# EAGLE schematic 5409668 (EAGLE 6.6.0)

## Sheet 1 of 2
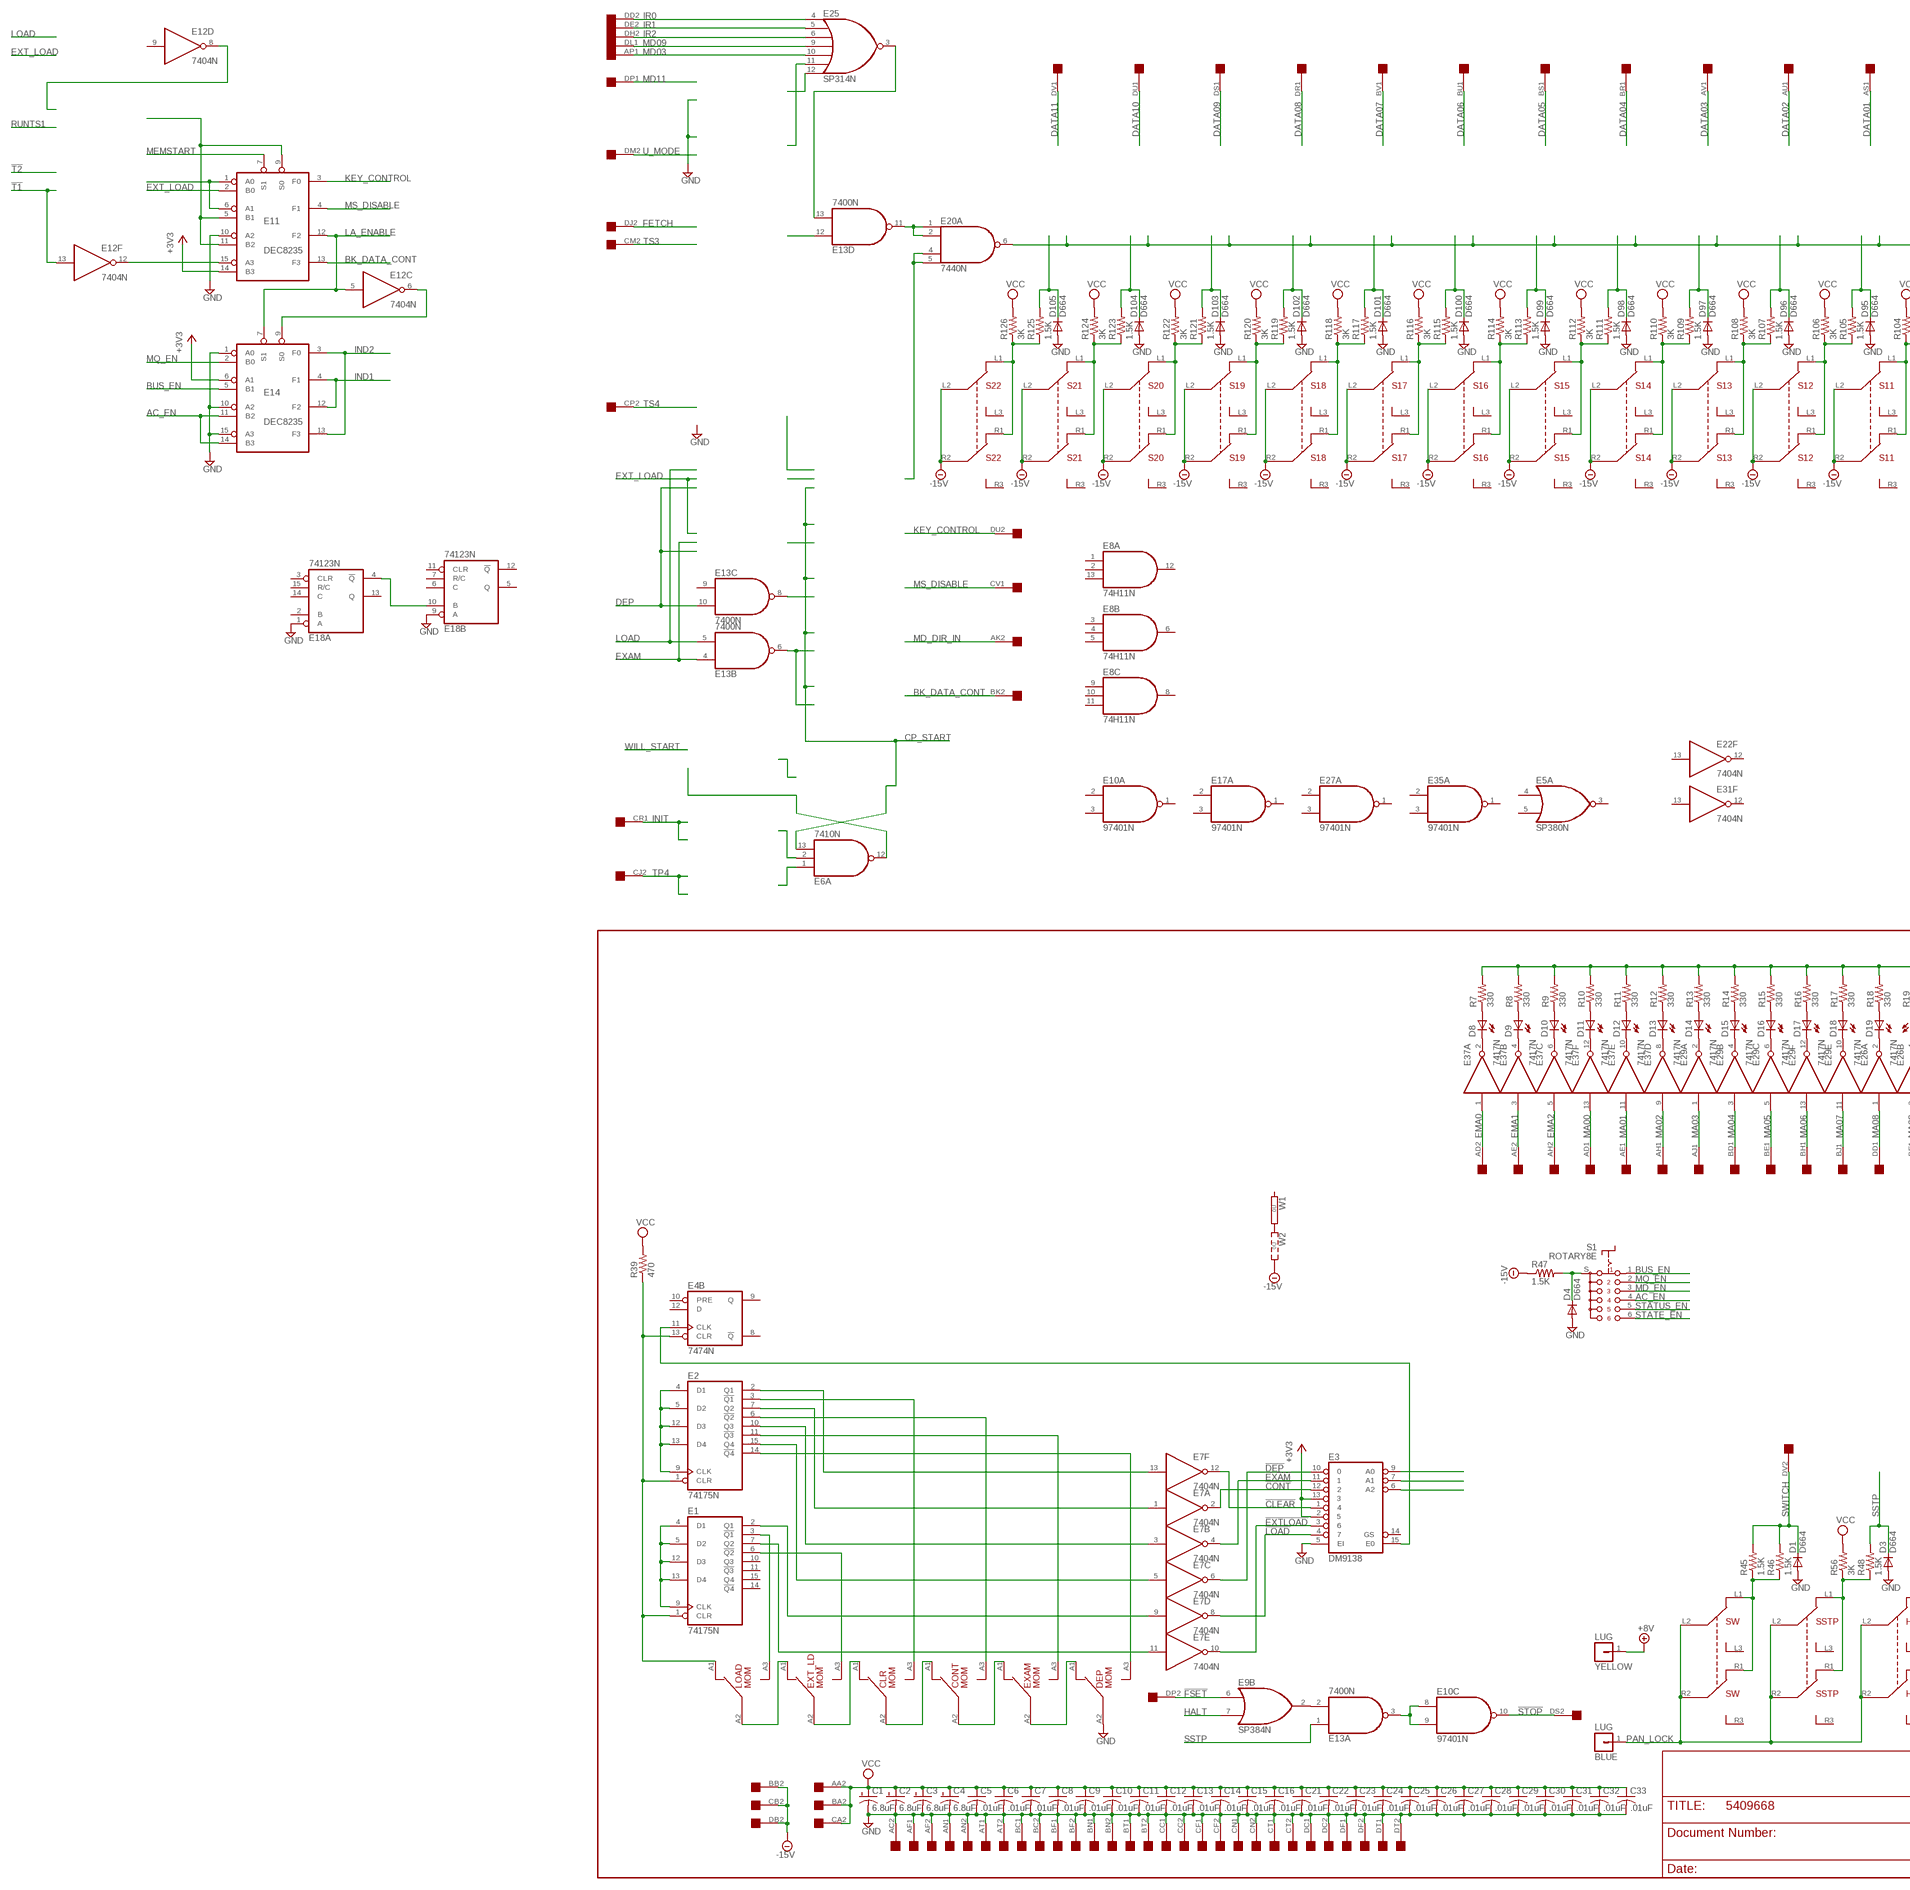
[diagram p0: schematic, sheet 1, part 1 of 2]
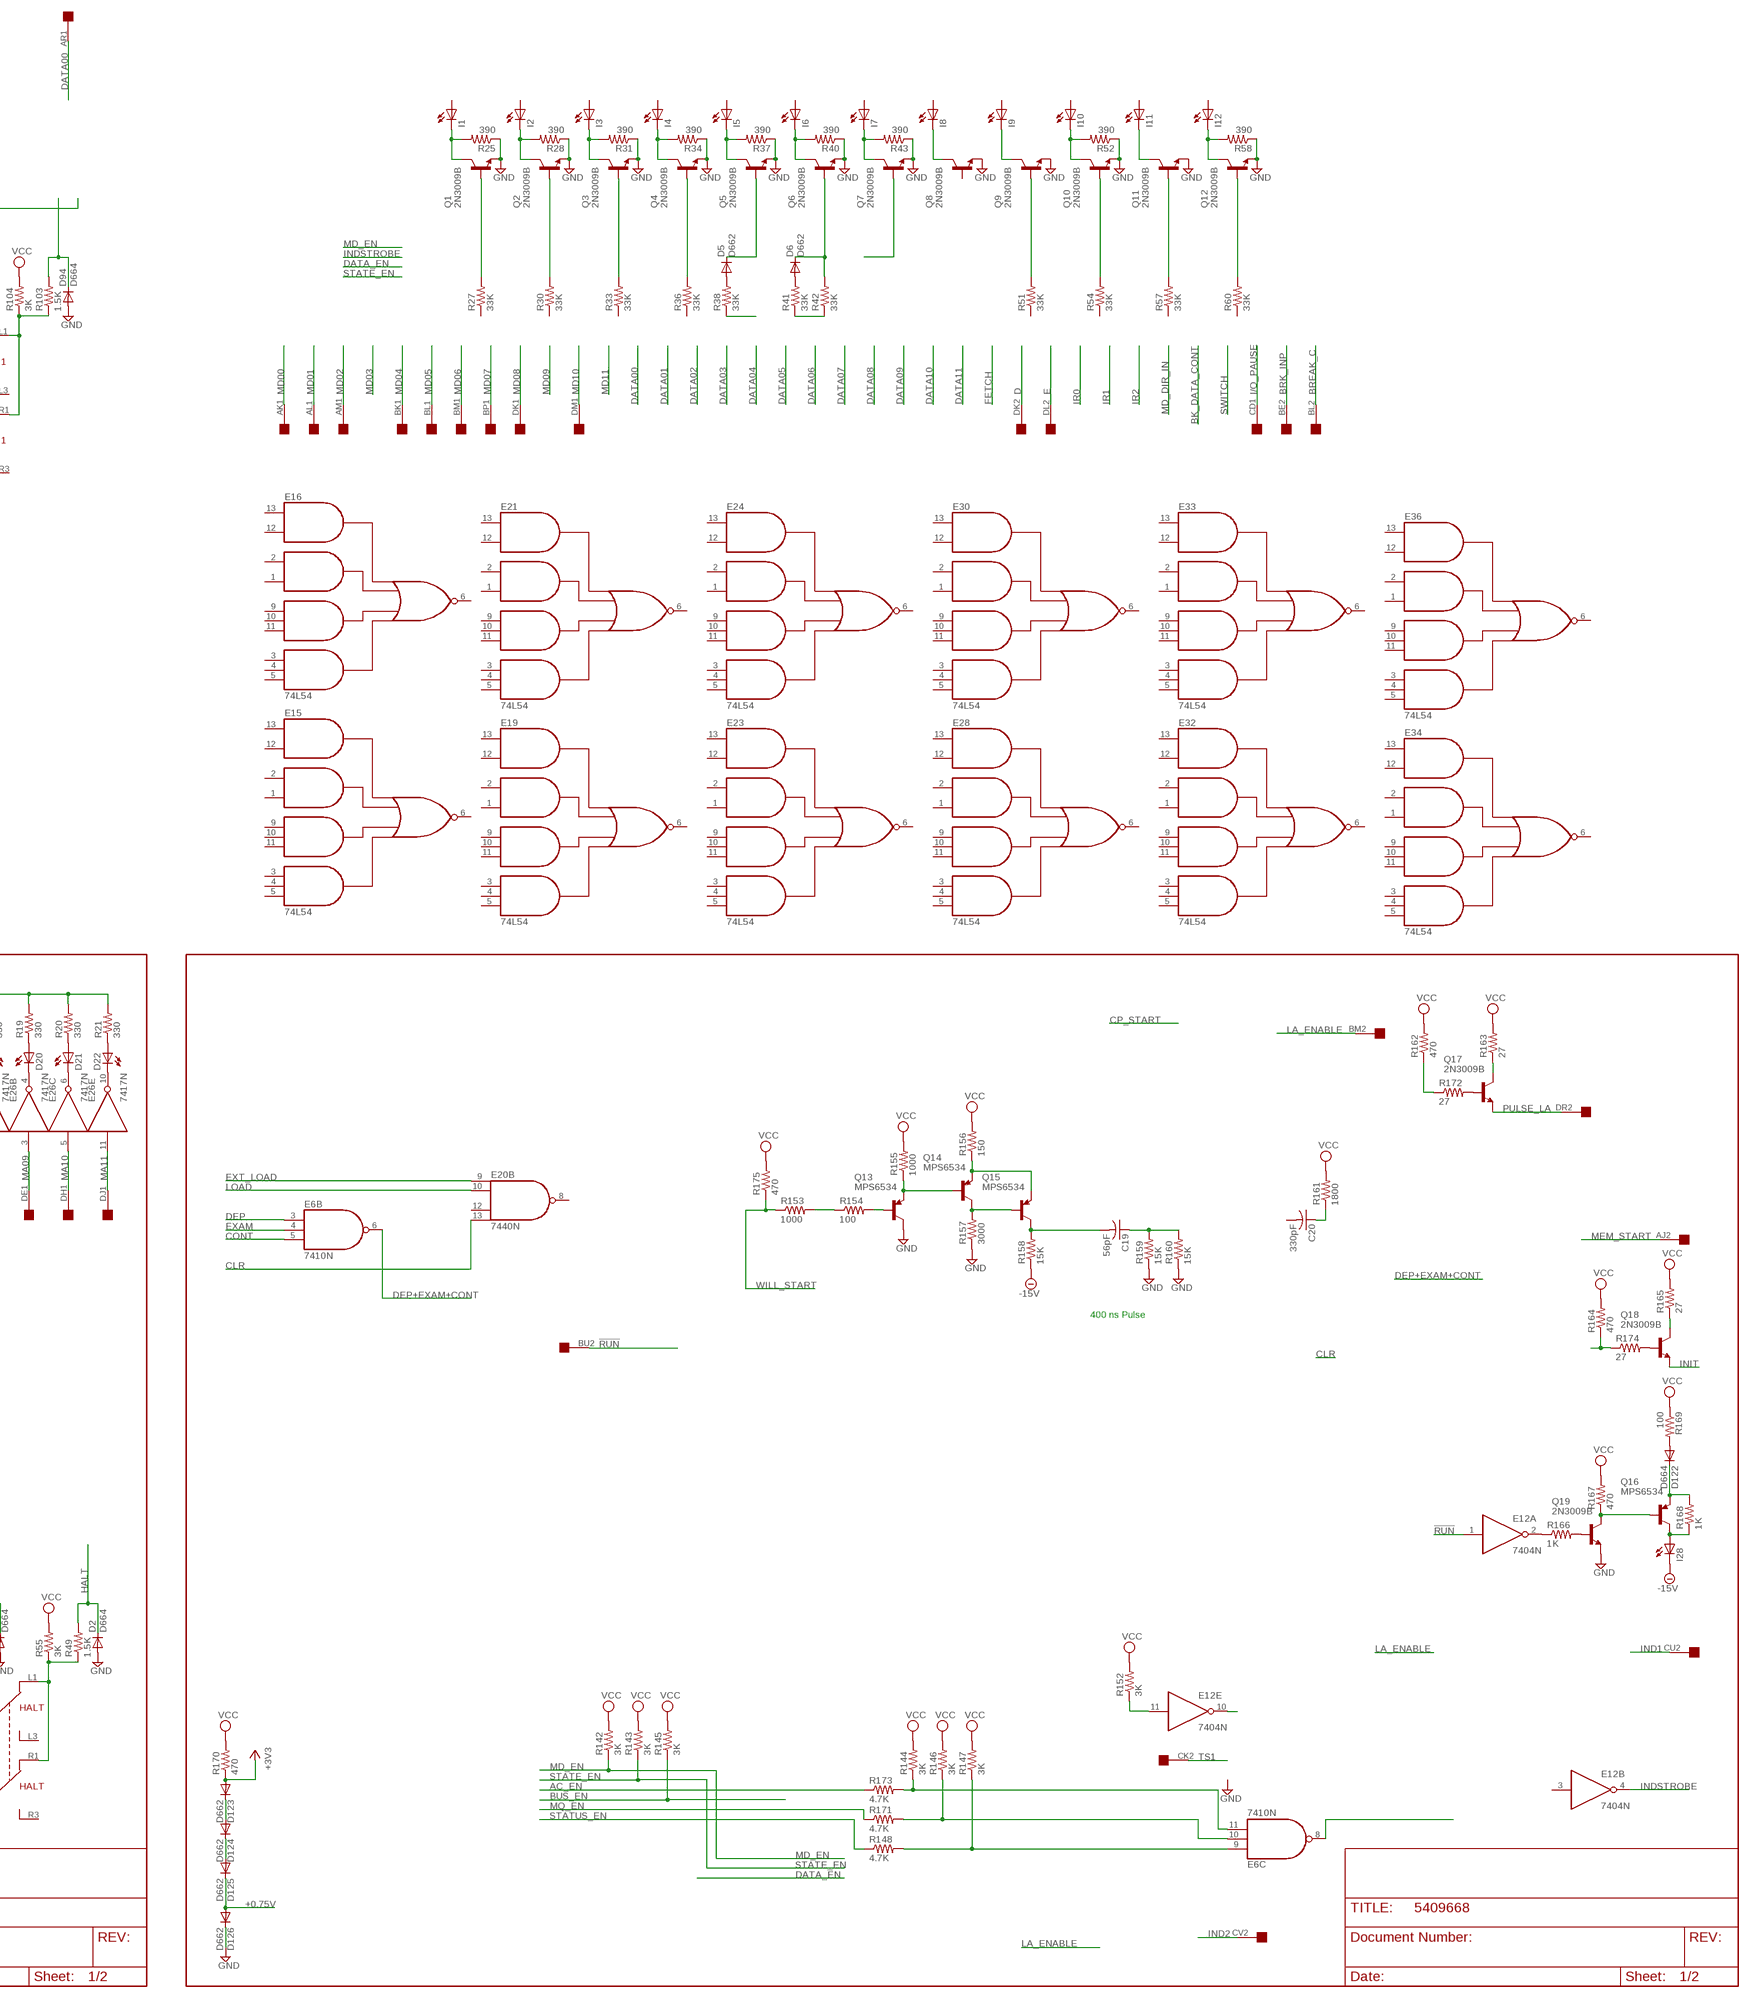
[diagram p1: schematic, sheet 1, part 2 of 2]

### Parts
BLUE  LUG  [SPADELUG]
C1  6.8uF  CPOL-USE20-8AXIAL  [E12-8]
C2  6.8uF  CPOL-USE20-8AXIAL  [E12-8]
C3  6.8uF  CPOL-USE20-8AXIAL  [E12-8]
C4  6.8uF  CPOL-USE20-8AXIAL  [E12-8]
C5  .01uF  C-US050-025X075  [C050-025X075]
C6  .01uF  C-US050-025X075  [C050-025X075]
C7  .01uF  C-US050-025X075  [C050-025X075]
C8  .01uF  C-US050-025X075  [C050-025X075]
C9  .01uF  C-US050-025X075  [C050-025X075]
C10  .01uF  C-US050-025X075  [C050-025X075]
C11  .01uF  C-US050-025X075  [C050-025X075]
C12  .01uF  C-US050-025X075  [C050-025X075]
C13  .01uF  C-US050-025X075  [C050-025X075]
C14  .01uF  C-US050-025X075  [C050-025X075]
C15  .01uF  C-US050-025X075  [C050-025X075]
C16  .01uF  C-US050-025X075  [C050-025X075]
C19  56pF  C-US050-025X075  [C050-025X075]
C20  330pF  C-US050-025X075  [C050-025X075]
C21  .01uF  C-US050-025X075  [C050-025X075]
C22  .01uF  C-US050-025X075  [C050-025X075]
C23  .01uF  C-US050-025X075  [C050-025X075]
C24  .01uF  C-US050-025X075  [C050-025X075]
C25  .01uF  C-US050-025X075  [C050-025X075]
C26  .01uF  C-US050-025X075  [C050-025X075]
C27  .01uF  C-US050-025X075  [C050-025X075]
C28  .01uF  C-US050-025X075  [C050-025X075]
C29  .01uF  C-US050-025X075  [C050-025X075]
C30  .01uF  C-US050-025X075  [C050-025X075]
C31  .01uF  C-US050-025X075  [C050-025X075]
C32  .01uF  C-US050-025X075  [C050-025X075]
C33  .01uF  C-US050-025X075  [C050-025X075]
CLR  SPDT8I  [SPDT8I]
CONT  SPDT8I  [SPDT8I]
D1  D664  1N4148DO35-10  [DO35-10]
D2  D664  1N4148DO35-10  [DO35-10]
D3  D664  1N4148DO35-10  [DO35-10]
D4  D664  1N4148DO35-10  [DO35-10]
D5  D662  1N4148DO35-10  [DO35-10]
D6  D662  1N4148DO35-10  [DO35-10]
D8  LED5MM  [LED5MM]
D9  LED5MM  [LED5MM]
D10  LED5MM  [LED5MM]
D11  LED5MM  [LED5MM]
D12  LED5MM  [LED5MM]
D13  LED5MM  [LED5MM]
D14  LED5MM  [LED5MM]
D15  LED5MM  [LED5MM]
D16  LED5MM  [LED5MM]
D17  LED5MM  [LED5MM]
D18  LED5MM  [LED5MM]
D19  LED5MM  [LED5MM]
D20  LED5MM  [LED5MM]
D21  LED5MM  [LED5MM]
D22  LED5MM  [LED5MM]
D94  D664  1N4148DO35-10  [DO35-10]
D95  D664  1N4148DO35-10  [DO35-10]
D96  D664  1N4148DO35-10  [DO35-10]
D97  D664  1N4148DO35-10  [DO35-10]
D98  D664  1N4148DO35-10  [DO35-10]
D99  D664  1N4148DO35-10  [DO35-10]
D100  D664  1N4148DO35-10  [DO35-10]
D101  D664  1N4148DO35-10  [DO35-10]
D102  D664  1N4148DO35-10  [DO35-10]
D103  D664  1N4148DO35-10  [DO35-10]
D104  D664  1N4148DO35-10  [DO35-10]
D105  D664  1N4148DO35-10  [DO35-10]
D122  D664  1N4148DO35-10  [DO35-10]
D123  D662  1N4148DO35-10  [DO35-10]
D124  D662  1N4148DO35-10  [DO35-10]
D125  D662  1N4148DO35-10  [DO35-10]
D126  D662  1N4148DO35-10  [DO35-10]
DEP  SPDT8I  [SPDT8I]
E1  74175N  [DIL16]
E2  74175N  [DIL16]
E3  DM9138  74LS348N  [DIL16]
E4  7474N  74S74N  [DIL14]
E5  SP380N  [DIL14]
E6  7410N  [DIL14]
E7  7404N  [DIL14]
E8  74H11N  74S11N  [DIL14]
E9  SP384N  [DIL14]
E10  97401N  74LS01N  [DIL14]
E11  DEC8235  [DIL16]
E12  7404N  [DIL14]
E13  7400N  [DIL14]
E14  DEC8235  [DIL16]
E15  74L54  74LS54  [DIL14]
E16  74L54  74LS54  [DIL14]
E17  97401N  74LS01N  [DIL14]
E18  74123N  [DIL16]
E19  74L54  74LS54  [DIL14]
E20  7440N  74S20N  [DIL14]
E21  74L54  74LS54  [DIL14]
E22  7404N  [DIL14]
E23  74L54  74LS54  [DIL14]
E24  74L54  74LS54  [DIL14]
E25  SP314N  [DIL14]
E26  7417N  [DIL14]
E27  97401N  74LS01N  [DIL14]
E28  74L54  74LS54  [DIL14]
E29  7417N  [DIL14]
E30  74L54  74LS54  [DIL14]
E31  7404N  [DIL14]
E32  74L54  74LS54  [DIL14]
E33  74L54  74LS54  [DIL14]
E34  74L54  74LS54  [DIL14]
E35  97401N  74LS01N  [DIL14]
E36  74L54  74LS54  [DIL14]
E37  7417N  [DIL14]
EXAM  SPDT8I  [SPDT8I]
EXT_LD  SPDT8I  [SPDT8I]
HALT  DPDT8I  [DPDT8I]
I1  LED5MM  [LED5MM]
I2  LED5MM  [LED5MM]
I3  LED5MM  [LED5MM]
I4  LED5MM  [LED5MM]
I5  LED5MM  [LED5MM]
I6  LED5MM  [LED5MM]
I7  LED5MM  [LED5MM]
I8  LED5MM  [LED5MM]
I9  LED5MM  [LED5MM]
I10  LED5MM  [LED5MM]
I11  LED5MM  [LED5MM]
I12  LED5MM  [LED5MM]
I28  LED5MM  [LED5MM]
LOAD  SPDT8I  [SPDT8I]
Q1  2N3009B  2N3019  [TO39]
Q2  2N3009B  2N3019  [TO39]
Q3  2N3009B  2N3019  [TO39]
Q4  2N3009B  2N3019  [TO39]
Q5  2N3009B  2N3019  [TO39]
Q6  2N3009B  2N3019  [TO39]
Q7  2N3009B  2N3019  [TO39]
Q8  2N3009B  2N3019  [TO39]
Q9  2N3009B  2N3019  [TO39]
Q10  2N3009B  2N3019  [TO39]
Q11  2N3009B  2N3019  [TO39]
Q12  2N3009B  2N3019  [TO39]
Q13  MPS6534  2N3637  [TO39]
Q14  MPS6534  2N3637  [TO39]
Q15  MPS6534  2N3637  [TO39]
Q16  MPS6534  2N3637  [TO39]
Q17  2N3009B  2N3019  [TO39]
Q18  2N3009B  2N3019  [TO39]
Q19  2N3009B  2N3019  [TO39]
R7  330  R-US_0207/10  [0207/10]
R8  330  R-US_0207/10  [0207/10]
R9  330  R-US_0207/10  [0207/10]
R10  330  R-US_0207/10  [0207/10]
R11  330  R-US_0207/10  [0207/10]
R12  330  R-US_0207/10  [0207/10]
R13  330  R-US_0207/10  [0207/10]
R14  330  R-US_0207/10  [0207/10]
R15  330  R-US_0207/10  [0207/10]
R16  330  R-US_0207/10  [0207/10]
R17  330  R-US_0207/10  [0207/10]
R18  330  R-US_0207/10  [0207/10]
R19  330  R-US_0207/10  [0207/10]
R20  330  R-US_0207/10  [0207/10]
R21  330  R-US_0207/10  [0207/10]
R25  390  R-US_0207/10  [0207/10]
R27  33K  R-US_0207/10  [0207/10]
R28  390  R-US_0207/10  [0207/10]
R30  33K  R-US_0207/10  [0207/10]
R31  390  R-US_0207/10  [0207/10]
R33  33K  R-US_0207/10  [0207/10]
R34  390  R-US_0207/10  [0207/10]
R36  33K  R-US_0207/10  [0207/10]
R37  390  R-US_0207/10  [0207/10]
R38  33K  R-US_0207/10  [0207/10]
R39  470  R-US_0207/10  [0207/10]
R40  390  R-US_0207/10  [0207/10]
R41  33K  R-US_0207/10  [0207/10]
R42  33K  R-US_0207/10  [0207/10]
R43  390  R-US_0207/10  [0207/10]
R45  1.5K  R-US_0207/10  [0207/10]
R46  1.5K  R-US_0207/10  [0207/10]
R47  1.5K  R-US_0207/10  [0207/10]
R48  1.5K  R-US_0207/10  [0207/10]
R49  1.5K  R-US_0207/10  [0207/10]
R51  33K  R-US_0207/10  [0207/10]
R52  390  R-US_0207/10  [0207/10]
R54  33K  R-US_0207/10  [0207/10]
R55  3K  R-US_0207/10  [0207/10]
R56  3K  R-US_0207/10  [0207/10]
R57  33K  R-US_0207/10  [0207/10]
R58  390  R-US_0207/10  [0207/10]
R60  33K  R-US_0207/10  [0207/10]
R103  1.5K  R-US_0207/10  [0207/10]
R104  3K  R-US_0207/10  [0207/10]
R105  1.5K  R-US_0207/10  [0207/10]
R106  3K  R-US_0207/10  [0207/10]
R107  1.5K  R-US_0207/10  [0207/10]
R108  3K  R-US_0207/10  [0207/10]
R109  1.5K  R-US_0207/10  [0207/10]
R110  3K  R-US_0207/10  [0207/10]
R111  1.5K  R-US_0207/10  [0207/10]
R112  3K  R-US_0207/10  [0207/10]
R113  1.5K  R-US_0207/10  [0207/10]
R114  3K  R-US_0207/10  [0207/10]
R115  1.5K  R-US_0207/10  [0207/10]
R116  3K  R-US_0207/10  [0207/10]
R117  1.5K  R-US_0207/10  [0207/10]
R118  3K  R-US_0207/10  [0207/10]
R119  1.5K  R-US_0207/10  [0207/10]
R120  3K  R-US_0207/10  [0207/10]
R121  1.5K  R-US_0207/10  [0207/10]
R122  3K  R-US_0207/10  [0207/10]
R123  1.5K  R-US_0207/10  [0207/10]
R124  3K  R-US_0207/10  [0207/10]
R125  1.5K  R-US_0207/10  [0207/10]
R126  3K  R-US_0207/10  [0207/10]
R142  3K  R-US_0207/10  [0207/10]
R143  3K  R-US_0207/10  [0207/10]
R144  3K  R-US_0207/10  [0207/10]
R145  3K  R-US_0207/10  [0207/10]
R146  3K  R-US_0207/10  [0207/10]
R147  3K  R-US_0207/10  [0207/10]
R148  4.7K  R-US_0207/10  [0207/10]
R152  3K  R-US_0207/10  [0207/10]
R153  1000  R-US_0207/10  [0207/10]
R154  100  R-US_0207/10  [0207/10]
R155  1000  R-US_0207/10  [0207/10]
R156  150  R-US_0207/10  [0207/10]
R157  3000  R-US_0207/10  [0207/10]
R158  15K  R-US_0207/10  [0207/10]
R159  15K  R-US_0207/10  [0207/10]
R160  15K  R-US_0207/10  [0207/10]
R161  1800  R-US_0207/10  [0207/10]
R162  470  R-US_0207/10  [0207/10]
R163  27  R-US_0207/10  [0207/10]
R164  470  R-US_0207/10  [0207/10]
R165  27  R-US_0207/10  [0207/10]
R166  1K  R-US_0207/10  [0207/10]
R167  470  R-US_0207/10  [0207/10]
R168  1K  R-US_0207/10  [0207/10]
R169  100  R-US_0207/10  [0207/10]
R170  470  R-US_0207/10  [0207/10]
R171  4.7K  R-US_0207/10  [0207/10]
R172  27  R-US_0207/10  [0207/10]
R173  4.7K  R-US_0207/10  [0207/10]
R174  27  R-US_0207/10  [0207/10]
R175  470  R-US_0204/7  [0204/7]
S1  ROTARY8E  [ROTARY-8E]
S11  DPDT8I  [DPDT8I]
S12  DPDT8I  [DPDT8I]
S13  DPDT8I  [DPDT8I]
S14  DPDT8I  [DPDT8I]
S15  DPDT8I  [DPDT8I]
S16  DPDT8I  [DPDT8I]
S17  DPDT8I  [DPDT8I]
S18  DPDT8I  [DPDT8I]
S19  DPDT8I  [DPDT8I]
S20  DPDT8I  [DPDT8I]
S21  DPDT8I  [DPDT8I]
S22  DPDT8I  [DPDT8I]
SSTP  DPDT8I  [DPDT8I]
SW  DPDT8I  [DPDT8I]
U$2  QUAD  [EDGE-CON8]
W1  W2  0R2  [0R2/10]
YELLOW  LUG  [SPADELUG]

### Nets
!CLEAR: E3.1 E7.12(F:O)
!CONT: E3.12 E7.2(A:O)
!DEP: E3.10 E7.6(C:O)
!EXAM: E3.11 E7.4(B:O)
!EXTLOAD: E3.3 E7.10(E:O)
!FSET: E9.6(B:I0) U$2.DP2
!LOAD: E3.4 E7.8(D:O)
!RUN: E12.1(A:I) U$2.BU2
!STOP: E10.10(C:O) U$2.DS2
!T1: E12.13(F:I)
+0.75V [Supply]: D125.C D126.A
+3V3: D123.A E3.2 E3.13 E11.14(B3) E14.6(A1) R170.1
+8V [Supply]: YELLOW.1
-15V [Supply]: I28.K(C) R47.1 R158.1 S11.L2(A2) S11.R2(B2) S12.L2(A2) S12.R2(B2) S13.L2(A2) S13.R2(B2) S14.L2(A2) S14.R2(B2) S15.L2(A2) S15.R2(B2) S16.L2(A2) S16.R2(B2) S17.L2(A2) S17.R2(B2) S18.L2(A2) S18.R2(B2) S19.L2(A2) S19.R2(B2) S20.L2(A2) S20.R2(B2) S21.L2(A2) S21.R2(B2) S22.L2(A2) S22.R2(B2) U$2.BB2 U$2.CB2 U$2.DB2 W1.3
AC_EN: E14.11(B2) E14.14(B3) R173.1 S1.4
BK_DATA_CONT: E11.13(F3) U$2.BK2
BREAK_C: U$2.BL2
BRK_INP: U$2.BE2
BUS_EN: E14.5(B1) R145.1 S1.1
CLR: E20.13(B:I3)
CONT: E6.5(B:I2)
CP_START: E6.13(A:I2)
D: U$2.DK2
DATA00: U$2.AR1
DATA01: U$2.AS1
DATA02: U$2.AU1
DATA03: U$2.AV1
DATA04: U$2.BR1
DATA05: U$2.BS1
DATA06: U$2.BU1
DATA07: U$2.BV1
DATA08: U$2.DR1
DATA09: U$2.DS1
DATA10: U$2.DU1
DATA11: U$2.DV1
DEP: E6.3(B:I0) E13.10(C:I1)
DEP+EXAM+CONT: E6.6(B:O)
E: U$2.DL2
EMA0: E37.1(A:I) U$2.AD2
EMA1: E37.3(B:I) U$2.AE2
EMA2: E37.5(C:I) U$2.AH2
EXAM: E6.4(B:I1) E13.4(B:I0)
EXT_LOAD: E11.2(B0) E20.9(B:I0)
FETCH: U$2.DJ2
GND [Supply]: C1.- C2.- C3.- C4.- C5.2 C6.2 C7.2 C8.2 C9.2 C10.2 C11.2 C12.2 C13.2 C14.2 C15.2 C16.2 C21.2 C22.2 C23.2 C24.2 C25.2 C26.2 C27.2 C28.2 C29.2 C30.2 C31.2 C32.2 C33.2 D1.A D2.A D3.A D4.A D94.A D95.A D96.A D97.A D98.A D99.A D100.A D101.A D102.A D103.A D104.A D105.A D126.C DEP.A2 E3.5(EI) E11.10(A2) E14.1(A0) E14.10(A2) E14.15(A3) E18.1(A:A) E18.9(B:A) Q1.1(E) Q2.1(E) Q3.1(E) Q4.1(E) Q5.1(E) Q6.1(E) Q7.1(E) Q8.1(E) Q9.1(E) Q10.1(E) Q11.1(E) Q12.1(E) Q13.3(C) Q19.1(E) R25.1 R28.1 R31.1 R34.1 R37.1 R40.1 R43.1 R52.1 R58.1 R157.1 R159.1 R160.1 U$2.AC2 U$2.AF1 U$2.AF2 U$2.AN1 U$2.AN2 U$2.AT1 U$2.AT2 U$2.BC1 U$2.BC2 U$2.BF1 U$2.BF2 U$2.BN1 U$2.BN2 U$2.BT1 U$2.BT2 U$2.CC1 U$2.CC2 U$2.CF1 U$2.CF2 U$2.CN1 U$2.CN2 U$2.CT1 U$2.CT2 U$2.DC1 U$2.DC2 U$2.DF1 U$2.DF2 U$2.DT1 U$2.DT2
HALT: D2.C E9.7(B:I1) R49.2
I/O_PAUSE: U$2.CD1
IND1: E14.4(F1) E14.12(F2) U$2.CU2
IND2: E14.3(F0) E14.13(F3) U$2.CV2
INDSTROBE: E12.4(B:O)
INIT: Q18.1(E) U$2.CR1
IR0: E25.4(I0) U$2.DD2
IR1: E25.5(I1) U$2.DE2
IR2: E25.6(I2) U$2.DH2
KEY_CONTROL: E11.3(F0) U$2.DU2
LA_ENABLE: E11.12(F2) E12.5(C:I) E14.7(S1) U$2.BM2
LAEXTLA: E12.8(D:O)
LOAD: E13.5(B:I1) E20.10(B:I1)
MA00: E37.13(F:I) U$2.AD1
MA01: E37.11(E:I) U$2.AE1
MA02: E37.9(D:I) U$2.AH1
MA03: E29.1(A:I) U$2.AJ1
MA04: E29.3(B:I) U$2.BD1
MA05: E29.5(C:I) U$2.BE1
MA06: E29.13(F:I) U$2.BH1
MA07: E29.11(E:I) U$2.BJ1
MA08: E26.1(A:I) U$2.DD1
MA09: E26.3(B:I) U$2.DE1
MA10: E26.5(C:I) U$2.DH1
MA11: E26.11(E:I) U$2.DJ1
MD00: U$2.AK1
MD01: U$2.AL1
MD02: U$2.AM1
MD03: E25.10(I4) U$2.AP1
MD04: U$2.BK1
MD05: U$2.BL1
MD06: U$2.BM1
MD07: U$2.BP1
MD08: U$2.DK1
MD09: E25.9(I3) U$2.DL1
MD10: U$2.DM1
MD11: U$2.DP1
MD_DIR_IN: U$2.AK2
MD_EN: R142.1 S1.3
MEM_START: U$2.AJ2
MEMSTART: E11.7(S1)
MQ_EN: E14.2(B0) R171.1 S1.2
MS_DISABLE: E11.4(F1) U$2.CV1
N$1: E25.11(I5)
N$2: E25.12(I6)
N$3: E13.13(D:I1) E25.3(O)
N$4: E13.12(D:I0)
N$5: E13.11(D:O) E20.1(A:I0) E20.2(A:I1)
N$7: E20.6(A:O)
N$8: R125.1 R126.1 S22.L1(A1) S22.R1(B1)
N$9: R121.1 R122.1 S20.L1(A1) S20.R1(B1)
N$10: D105.C R125.2
N$11: R123.1 R124.1 S21.L1(A1) S21.R1(B1)
N$12: D103.C R121.2
N$13: R117.1 R118.1 S18.L1(A1) S18.R1(B1)
N$14: D104.C R123.2
N$15: R119.1 R120.1 S19.L1(A1) S19.R1(B1)
N$16: D101.C R117.2
N$17: R109.1 R110.1 S14.L1(A1) S14.R1(B1)
N$18: D102.C R119.2
N$19: R115.1 R116.1 S17.L1(A1) S17.R1(B1)
N$20: D97.C R109.2
N$21: R45.1 R46.1 SW.L1(A1) SW.R1(B1)
N$22: D100.C R115.2
N$23: E1.3(!Q1) LOAD.A3
N$24: R113.1 R114.1 S16.L1(A1) S16.R1(B1)
N$25 [Supply]: D8.K(C) E37.2(A:O)
N$26: D99.C R113.2
N$27: E1.6(!Q2) EXT_LD.A3
N$28: R111.1 R112.1 S15.L1(A1) S15.R1(B1)
N$30: D98.C R111.2
N$31: CLR.A3 E2.3(!Q1)
N$32: R107.1 R108.1 S13.L1(A1) S13.R1(B1)
N$33: D96.C R107.2
N$34: R105.1 R106.1 S12.L1(A1) S12.R1(B1)
N$35: D95.C R105.2
N$36: R103.1 R104.1 S11.L1(A1) S11.R1(B1)
N$37: D94.C R103.2
N$39: CONT.A3 E2.6(!Q2)
N$41: E2.11(!Q3) EXAM.A3
N$42: E13.8(C:O)
N$43: R48.1 R56.1 SSTP.L1(A1) SSTP.R1(B1)
N$44: E13.6(B:O)
N$45: HALT.L1(A1) HALT.R1(B1) R49.1 R55.1
N$47: E9.2(B:O) E13.2(A:I1)
N$48: DEP.A3 E2.14(!Q4)
N$49: E20.4(A:I2) E20.5(A:I3)
N$54: R153.2 R154.1
N$55: Q13.2(B) R154.2
N$56: Q13.1(E) Q14.2(B) R155.1
N$57: Q14.1(E) Q15.1(E) R156.1
N$58: Q14.3(C) Q15.2(B) R157.2
N$59: C19.2 Q15.3(C) R158.2
N$61: C19.1 R159.2 R160.2
N$64: C20.1 R161.1
N$68: Q17.2(B) R172.2
N$69: Q17.3(C) R163.1
N$70: R162.1 R172.1
N$71: E6.2(A:I1)
N$72: E6.1(A:I0)
N$74: E6.12(A:O)
N$76: Q1.2(B) R27.2
N$77 [Supply]: I12.K(C) Q12.3(C) R58.2
N$80: Q2.2(B) R30.2
N$81 [Supply]: I11.K(C) Q11.3(C)
N$84: Q3.2(B) R33.2
N$85 [Supply]: I10.K(C) Q10.3(C) R52.2
N$88: Q4.2(B) R36.2
N$89 [Supply]: I4.K(C) Q4.3(C) R34.2
N$90: R38.1
N$91: D5.A R38.2
N$92: D5.C Q5.2(B)
N$93 [Supply]: I8.K(C) Q8.3(C)
N$94: R41.1 R42.1
N$95: D6.A R41.2
N$96: D6.C Q6.2(B) R42.2
N$97 [Supply]: I7.K(C) Q7.3(C) R43.2
N$100: Q7.2(B)
N$101 [Supply]: I6.K(C) Q6.3(C) R40.2
N$103: R7.2 R8.2 R9.2 R10.2 R11.2 R12.2 R13.2 R14.2 R15.2 R16.2 R17.2 R18.2 R19.2 R20.2 R21.2
N$105 [Supply]: I5.K(C) Q5.3(C) R37.2
N$107: E1.4(D1) E1.5(D2) E1.9(CLK) E1.12(D3) E1.13(D4)
N$108: Q9.2(B) R51.2
N$109: I9.K(C) Q9.3(C)
N$111: E2.4(D1) E2.5(D2) E2.9(CLK) E2.12(D3) E2.13(D4)
N$112: Q10.2(B) R54.2
N$113 [Supply]: I3.K(C) Q3.3(C) R31.2
N$115: E1.1(CLR) E2.1(CLR) E4.13(B:CLR) LOAD.A1 R39.1
N$116: Q11.2(B) R57.2
N$117 [Supply]: I2.K(C) Q2.3(C) R28.2
N$119: EXT_LD.A1 LOAD.A2
N$120: Q12.2(B) R60.2
N$121 [Supply]: I1.K(C) Q1.3(C) R25.2
N$122: E6.11(C:I2) R144.1 R173.2
N$135: CLR.A1 EXT_LD.A2
N$136: CLR.A2 CONT.A1
N$137: CONT.A2 EXAM.A1
N$138 [Supply]: DEP.A1 EXAM.A2
N$139: E2.2(Q1) E7.13(F:I)
N$140: E2.7(Q2) E7.1(A:I)
N$141: E2.10(Q3) E7.3(B:I)
N$142: E2.15(Q4) E7.5(C:I)
N$143: E1.2(Q1) E7.9(D:I)
N$144: E1.7(Q2) E7.11(E:I)
N$145 [Supply]: D4.C R47.2 S1.S
N$147 [Supply]: D9.K(C) E37.4(B:O)
N$173 [Supply]: D10.K(C) E37.6(C:O)
N$174 [Supply]: D11.K(C) E37.12(F:O)
N$175 [Supply]: D12.K(C) E37.10(E:O)
N$180 [Supply]: D13.K(C) E37.8(D:O)
N$181 [Supply]: D14.K(C) E29.2(A:O)
N$182 [Supply]: D15.K(C) E29.4(B:O)
N$183 [Supply]: D16.K(C) E29.6(C:O)
N$184 [Supply]: D17.K(C) E29.12(F:O)
N$185 [Supply]: D18.K(C) E29.10(E:O)
N$186 [Supply]: D19.K(C) E26.2(A:O)
N$190 [Supply]: D20.K(C) E26.4(B:O)
N$191 [Supply]: D21.K(C) E26.6(C:O)
N$192 [Supply]: D22.K(C) E26.10(E:O)
N$193: Q18.3(C) R165.1
N$203: E6.8(C:O)
N$207: E10.8(C:I0) E10.9(C:I1) E13.3(A:O)
N$208: E11.1(A0) E11.6(A1)
N$210: E12.10(E:O)
N$213: E12.2(A:O) R166.1
N$214: D124.C D125.A
N$215 [Supply]: D123.C D124.A
N$216: Q19.2(B) R166.2
N$217: Q16.2(B) Q19.3(C) R167.1
N$218: D122.A R169.2
N$219: D122.C Q16.1(E) R168.2
N$220 [Supply]: I28.A Q16.3(C) R168.1
N$221: R164.1 R174.1
N$222: Q18.2(B) R174.2
N$226: E12.11(E:I) R152.1
N$227: E11.5(B1) E11.9(S0) E11.11(B2)
N$228: E6.10(C:I1) R146.1 R171.2
N$229: E6.9(C:I0) R147.1 R148.2
N$230: E18.4(A:!Q) E18.10(B:B)
N$231: E11.15(A3) E12.12(F:O)
N$232: E3.7(A1)
N$233: E3.9(A0)
N$234: E3.6(A2)
N$235: E3.15(E0) E4.11(B:CLK)
N$236: D8.A R7.1
N$237: D9.A R8.1
N$238: D10.A R9.1
N$239: D11.A R10.1
N$240: D12.A R11.1
N$241: E12.6(C:O) E14.9(S0)
N$242: D13.A R12.1
N$243: D14.A R13.1
N$244: D15.A R14.1
N$245: D16.A R15.1
N$246: D17.A R16.1
N$247: D18.A R17.1
N$248: D19.A R18.1
N$249: D20.A R19.1
N$250: D21.A R20.1
N$251: D22.A R21.1
PAN_LOCK [Supply]: BLUE.1 HALT.L2(A2) HALT.R2(B2) SSTP.L2(A2) SSTP.R2(B2) SW.L2(A2) SW.R2(B2)
PULSE_LA: Q17.1(E) U$2.DR2
SSTP: D3.C E13.1(A:I0) R48.2
STATE_EN: R143.1 S1.6
STATUS_EN: R148.1 S1.5
SWITCH: D1.C R45.2 R46.2 U$2.DV2
TP4: U$2.CJ2
TS1: U$2.CK2
TS3: U$2.CM2
TS4: U$2.CP2
U_MODE: U$2.DM2
VCC [Supply]: C1.+ C2.+ C3.+ C4.+ C5.1 C6.1 C7.1 C8.1 C9.1 C10.1 C11.1 C12.1 C13.1 C14.1 C15.1 C16.1 C21.1 C22.1 C23.1 C24.1 C25.1 C26.1 C27.1 C28.1 C29.1 C30.1 C31.1 C32.1 C33.1 R39.2 R55.2 R56.2 R104.2 R106.2 R108.2 R110.2 R112.2 R114.2 R116.2 R118.2 R120.2 R122.2 R124.2 R126.2 R142.2 R143.2 R144.2 R145.2 R146.2 R147.2 R152.2 R155.2 R156.2 R161.2 R162.2 R163.2 R164.2 R165.2 R167.2 R169.1 R170.2 R175.2 U$2.AA2 U$2.BA2 U$2.CA2
WILL_START: R153.1 R175.1
Unconnected: C20.2 E1.10(Q3) E1.11(!Q3) E1.14(!Q4) E1.15(Q4) E3.14(GS) E4.1(A:CLR) E4.2(A:D) E4.3(A:CLK) E4.4(A:PRE) E4.5(A:Q) E4.6(A:!Q) E4.8(B:!Q) E4.9(B:Q) E4.10(B:PRE) E4.12(B:D) E5.2(B:O) E5.3(A:O) E5.4(A:I0) E5.5(A:I1) E5.6(B:I0) E5.7(B:I1) E5.9(C:I0) E5.10(C:I1) E5.11(D:I0) E5.12(D:I1) E5.13(D:O) E5.14(C:O) E8.1(A:I0) E8.2(A:I1) E8.3(B:I0) E8.4(B:I1) E8.5(B:I2) E8.6(B:O) E8.8(C:O) E8.9(C:I0) E8.10(C:I1) E8.11(C:I2) E8.12(A:O) E8.13(A:I2) E9.3(A:O) E9.4(A:I0) E9.5(A:I1) E9.9(C:I0) E9.10(C:I1) E9.11(D:I0) E9.12(D:I1) E9.13(D:O) E9.14(C:O) E10.1(A:O) E10.2(A:I0) E10.3(A:I1) E10.4(B:O) E10.5(B:I0) E10.6(B:I1) E10.11(D:I0) E10.12(D:I1) E10.13(D:O) E12.3(B:I) E12.9(D:I) E13.9(C:I0) E15.1(I4) E15.2(I3) E15.3(I8) E15.4(I9) E15.5(I10) E15.6(O) E15.9(I5) E15.10(I6) E15.11(I7) E15.12(I2) E15.13(I1) E16.1(I4) E16.2(I3) E16.3(I8) E16.4(I9) E16.5(I10) E16.6(O) E16.9(I5) E16.10(I6) E16.11(I7) E16.12(I2) E16.13(I1) E17.1(A:O) E17.2(A:I0) E17.3(A:I1) E17.4(B:O) E17.5(B:I0) E17.6(B:I1) E17.8(C:I0) E17.9(C:I1) E17.10(C:O) E17.11(D:I0) E17.12(D:I1) E17.13(D:O) E18.2(A:B) E18.3(A:CLR) E18.5(B:Q) E18.6(B:C) E18.7(B:R/C) E18.11(B:CLR) E18.12(B:!Q) E18.13(A:Q) E18.14(A:C) E18.15(A:R/C) E19.1(I4) E19.2(I3) E19.3(I8) E19.4(I9) E19.5(I10) E19.6(O) E19.9(I5) E19.10(I6) E19.11(I7) E19.12(I2) E19.13(I1) E20.8(B:O) E20.12(B:I2) E21.1(I4) E21.2(I3) E21.3(I8) E21.4(I9) E21.5(I10) E21.6(O) E21.9(I5) E21.10(I6) E21.11(I7) E21.12(I2) E21.13(I1) E22.1(A:I) E22.2(A:O) E22.3(B:I) E22.4(B:O) E22.5(C:I) E22.6(C:O) E22.8(D:O) E22.9(D:I) E22.10(E:O) E22.11(E:I) E22.12(F:O) E22.13(F:I) E23.1(I4) E23.2(I3) E23.3(I8) E23.4(I9) E23.5(I10) E23.6(O) E23.9(I5) E23.10(I6) E23.11(I7) E23.12(I2) E23.13(I1) E24.1(I4) E24.2(I3) E24.3(I8) E24.4(I9) E24.5(I10) E24.6(O) E24.9(I5) E24.10(I6) E24.11(I7) E24.12(I2) E24.13(I1) E26.8(D:O) E26.9(D:I) E26.12(F:O) E26.13(F:I) E27.1(A:O) E27.2(A:I0) E27.3(A:I1) E27.4(B:O) E27.5(B:I0) E27.6(B:I1) E27.8(C:I0) E27.9(C:I1) E27.10(C:O) E27.11(D:I0) E27.12(D:I1) E27.13(D:O) E28.1(I4) E28.2(I3) E28.3(I8) E28.4(I9) E28.5(I10) E28.6(O) E28.9(I5) E28.10(I6) E28.11(I7) E28.12(I2) E28.13(I1) E29.8(D:O) E29.9(D:I) E30.1(I4) E30.2(I3) E30.3(I8) E30.4(I9) E30.5(I10) E30.6(O) E30.9(I5) E30.10(I6) E30.11(I7) E30.12(I2) E30.13(I1) E31.1(A:I) E31.2(A:O) E31.3(B:I) E31.4(B:O) E31.5(C:I) E31.6(C:O) E31.8(D:O) E31.9(D:I) E31.10(E:O) E31.11(E:I) E31.12(F:O) E31.13(F:I) E32.1(I4) E32.2(I3) E32.3(I8) E32.4(I9) E32.5(I10) E32.6(O) E32.9(I5) E32.10(I6) E32.11(I7) E32.12(I2) E32.13(I1) E33.1(I4) E33.2(I3) E33.3(I8) E33.4(I9) E33.5(I10) E33.6(O) E33.9(I5) E33.10(I6) E33.11(I7) E33.12(I2) E33.13(I1) E34.1(I4) E34.2(I3) E34.3(I8) E34.4(I9) E34.5(I10) E34.6(O) E34.9(I5) E34.10(I6) E34.11(I7) E34.12(I2) E34.13(I1) E35.1(A:O) E35.2(A:I0) E35.3(A:I1) E35.4(B:O) E35.5(B:I0) E35.6(B:I1) E35.8(C:I0) E35.9(C:I1) E35.10(C:O) E35.11(D:I0) E35.12(D:I1) E35.13(D:O) E36.1(I4) E36.2(I3) E36.3(I8) E36.4(I9) E36.5(I10) E36.6(O) E36.9(I5) E36.10(I6) E36.11(I7) E36.12(I2) E36.13(I1) HALT.L3(A3) HALT.R3(B3) I1.A I2.A I3.A I4.A I5.A I6.A I7.A I8.A I9.A I10.A I11.A I12.A Q8.2(B) R27.1 R30.1 R33.1 R36.1 R51.1 R54.1 R57.1 R60.1 S11.L3(A3) S11.R3(B3) S12.L3(A3) S12.R3(B3) S13.L3(A3) S13.R3(B3) S14.L3(A3) S14.R3(B3) S15.L3(A3) S15.R3(B3) S16.L3(A3) S16.R3(B3) S17.L3(A3) S17.R3(B3) S18.L3(A3) S18.R3(B3) S19.L3(A3) S19.R3(B3) S20.L3(A3) S20.R3(B3) S21.L3(A3) S21.R3(B3) S22.L3(A3) S22.R3(B3) SSTP.L3(A3) SSTP.R3(B3) SW.L3(A3) SW.R3(B3) U$2.AA1 U$2.AB1 U$2.AB2 U$2.AC1 U$2.AL2 U$2.AM2 U$2.AP2 U$2.AR2 U$2.AS2 U$2.AU2 U$2.AV2 U$2.BA1 U$2.BB1 U$2.BD2 U$2.BH2 U$2.BJ2 U$2.BP2 U$2.BR2 U$2.BS2 U$2.BV2 U$2.CA1 U$2.CB1 U$2.CD2 U$2.CE1 U$2.CE2 U$2.CH1 U$2.CH2 U$2.CJ1 U$2.CK1 U$2.CL1 U$2.CL2 U$2.CM1 U$2.CP1 U$2.CR2 U$2.CS1 U$2.CS2 U$2.CU1 U$2.DA1 U$2.DA2 U$2.DB1 U$2.DN1 U$2.DN2 W1.1 W1.2

### Notes on the sheet
- 400 ns Pulse

## Sheet 2 of 2

## Power pins joined to a net without a drawn wire
GND: E1.8(GND) E2.8(GND) E3.8(GND) E4.7(P:GND) E5.1(P:GND) E6.7(P:GND) E7.7(P:GND) E8.7(P:GND) E9.1(GND) E10.7(P:GND) E11.8(GND) E12.7(P:GND) E13.7(P:GND) E14.8(GND) E15.7(GND) E16.7(GND) E17.7(P:GND) E18.8(P:GND) E19.7(GND) E20.7(P:GND) E21.7(GND) E22.7(P:GND) E23.7(GND) E24.7(GND) E25.1(GND) E26.7(P:GND) E27.7(P:GND) E28.7(GND) E29.7(P:GND) E30.7(GND) E31.7(P:GND) E32.7(GND) E33.7(GND) E34.7(GND) E35.7(P:GND) E36.7(GND) E37.7(P:GND)
VCC: E1.16(VCC) E2.16(VCC) E3.16(VCC) E4.14(P:VCC) E5.8(P:VCC) E6.14(P:VCC) E7.14(P:VCC) E8.14(P:VCC) E9.8(VCC) E10.14(P:VCC) E11.16(VCC) E12.14(P:VCC) E13.14(P:VCC) E14.16(VCC) E15.14(VCC) E16.14(VCC) E17.14(P:VCC) E18.16(P:VCC) E19.14(VCC) E20.14(P:VCC) E21.14(VCC) E22.14(P:VCC) E23.14(VCC) E24.14(VCC) E25.8(VCC) E26.14(P:VCC) E27.14(P:VCC) E28.14(VCC) E29.14(P:VCC) E30.14(VCC) E31.14(P:VCC) E32.14(VCC) E33.14(VCC) E34.14(VCC) E35.14(P:VCC) E36.14(VCC) E37.14(P:VCC)

## Library data of the parts
BLUE YELLOW = dec-con:LUG: Spade Lug
C1-C4 = dec-con:CPOL-USE20-8AXIAL: A 0.8 inch electrolytic.
C5-C16 C19-C33 = rcl:C-US: CAPACITOR, American symbol
CLR CONT DEP EXAM EXT_LD LOAD = dec-con:SPDT8I: SPDT Momentary, as used in 8/i.
D1-D6 D94-D105 D122-D126 = diode:1N4148: DIODE high speed (Philips)
D8-D22 I1-I12 I28 = led:LED: LED OSRAM: - CHIPLED LG R971, LG N971, LY N971, LG Q971, LY Q971, LO R971, LY R971 LH N974, LH R974 LS Q976, LO Q976, LY Q976 LO Q996 - Hyper CHIPLED LW Q18S LB Q993, LB Q99A, LB R99A - SideLED LS A670, LO A670, LY A670, LG A670, LP A670 LB A673, LV A673, LT A673, LW A673 LH A674 LY A675 LS A676, LA A676, LO A676, LY A676, LW A676 LS A679, LY A679, LG A679 - Hyper Micro SIDELED® LS Y876, LA Y876, LO Y876, LY Y876 LT Y87S - SmartLED LW L88C, LW L88S LB L89C, LB L89S, LG L890 LS L89K, LO L89K, LY L89K LS L896, LA L896, LO L896, LY L896 - TOPLED LS T670, LO T670, LY T670, LG T670, LP T670 LSG T670, LSP T670, LSY T670, LOP T670, LYG T670 LG T671, LOG T671, LSG T671 LB T673, LV T673, LT T673, LW T673 LH T674 LS T676, LA T676, LO T676, LY T676, LB T676, LH T676, LSB T676, LW T676 LB T67C, LV T67C, LT T67C, LS T67K, LO T67K, LY T67K, LW E67C LS E67B, LA E67B, LO E67B, LY E67B, LB E67C, LV E67C, LT E67C LW T67C LS T679, LY T679, LG T679 LS T770, LO T770, LY T770, LG T770, LP T770 LB T773, LV T773, LT T773, LW T773 LH T774 LS E675, LA E675, LY E675, LS T675 LS T776, LA T776, LO T776, LY T776, LB T776 LHGB T686 LT T68C, LB T68C - Hyper Mini TOPLED® LB M676 - Mini TOPLED Santana® LG M470 LS M47K, LO M47K, LY M47K Source: http://www.osram.convergy.de LUXEON: - LUMILED® LXK2-PW12-R00, LXK2-PW12-S00, LXK2-PW14-U00, LXK2-PW14-V00 LXK2-PM12-R00, LXK2-PM12-S00, LXK2-PM14-U00 LXK2-PE12-Q00, LXK2-PE12-R00, LXK2-PE12-S00, LXK2-PE14-T00, LXK2-PE14-U00 LXK2-PB12-K00, LXK2-PB12-L00, LXK2-PB12-M00, LXK2-PB14-N00, LXK2-PB14-P00, LXK2-PB14-Q00 LXK2-PR12-L00, LXK2-PR12-M00, LXK2-PR14-Q00, LXK2-PR14-R00 LXK2-PD12-Q00, LXK2-PD12-R00, LXK2-PD12-S00 LXK2-PH12-R00, LXK2-PH12-S00 LXK2-PL12-P00, LXK2-PL12-Q00, LXK2-PL12-R00 Source: www.luxeon.com KINGBRIGHT: KA-3528ASYC Source: www.kingbright.com
E1 E2 = 74xx-us:74*175: Qadruple D type FLIP FLOP, clear
E3 = 74xx-eu:74*348: 8-to 3 line PRIORITY ENCODER, 3-state
E4 = 74xx-us:74*74: Dual D type positive edge triggered FLIP FLOP, preset and clear
E5 = dec-con:SP380: Quad NOR gate (use 8640)
E6 = 74xx-us:74*10: Triple 3-input NAND gate
E7 E12 E22 E31 = 74xx-us:74*04: Hex INVERTER
E8 = 74xx-us:74*11: Triple 3-input AND gate
E9 = dec-con:SP384: Quad OR gate
E10 E17 E27 E35 = 74xx-us:74*01: Quad 2-input NAND gate, open collector
E11 E14 = dec-con:DEC8235: 4-bit data selector
E13 = 74xx-us:74*00: Quad 2-input NAND gate
E15 E16 E19 E21 E23 E24 E28 E30 E32-E34 E36 = dec-con:74LS54: 4-wide AND-OR-INVERT Gate
E18 = 74xx-us:74*123: Retriggerable monostable MULTIVIBRATOR
E20 = 74xx-us:74*20: Dual 4-input NAND gate
E25 = dec-con:SP314: 7-Input NOR gate
E26 E29 E37 = 74xx-us:74*17: Hex INVERTER, open collector, high-voltage
HALT S11-S22 SSTP SW = dec-con:DPDT8I: DPDT switch as used in 8/i.
Q1-Q12 Q17-Q19 = transistor-npn:2N3019: NPN Transistor
Q13-Q16 = transistor-pnp:2N3637*: PNP Transistror
R7-R21 R25 R27 R28 R30 R31 R33 R34 R36-R43 R45-R49 R51 R52 R54-R58 R60 R103-R126 R142-R148 R152-R175 = rcl:R-US_: RESISTOR, American symbol
S1 = dec-con:ROTARY8E: Rotary Reed Switch, as used in early 8/E bulb panels.
U$2 = dec-con:QUAD: Quad-Height DEC board
W1 = jumper:0R2: Bridge switch 0R 2 x 10mm

## Net classes
1 Supply: width 0.813 mm